# EAGLE design (S)NES2USB (EAGLE 9.5.1)
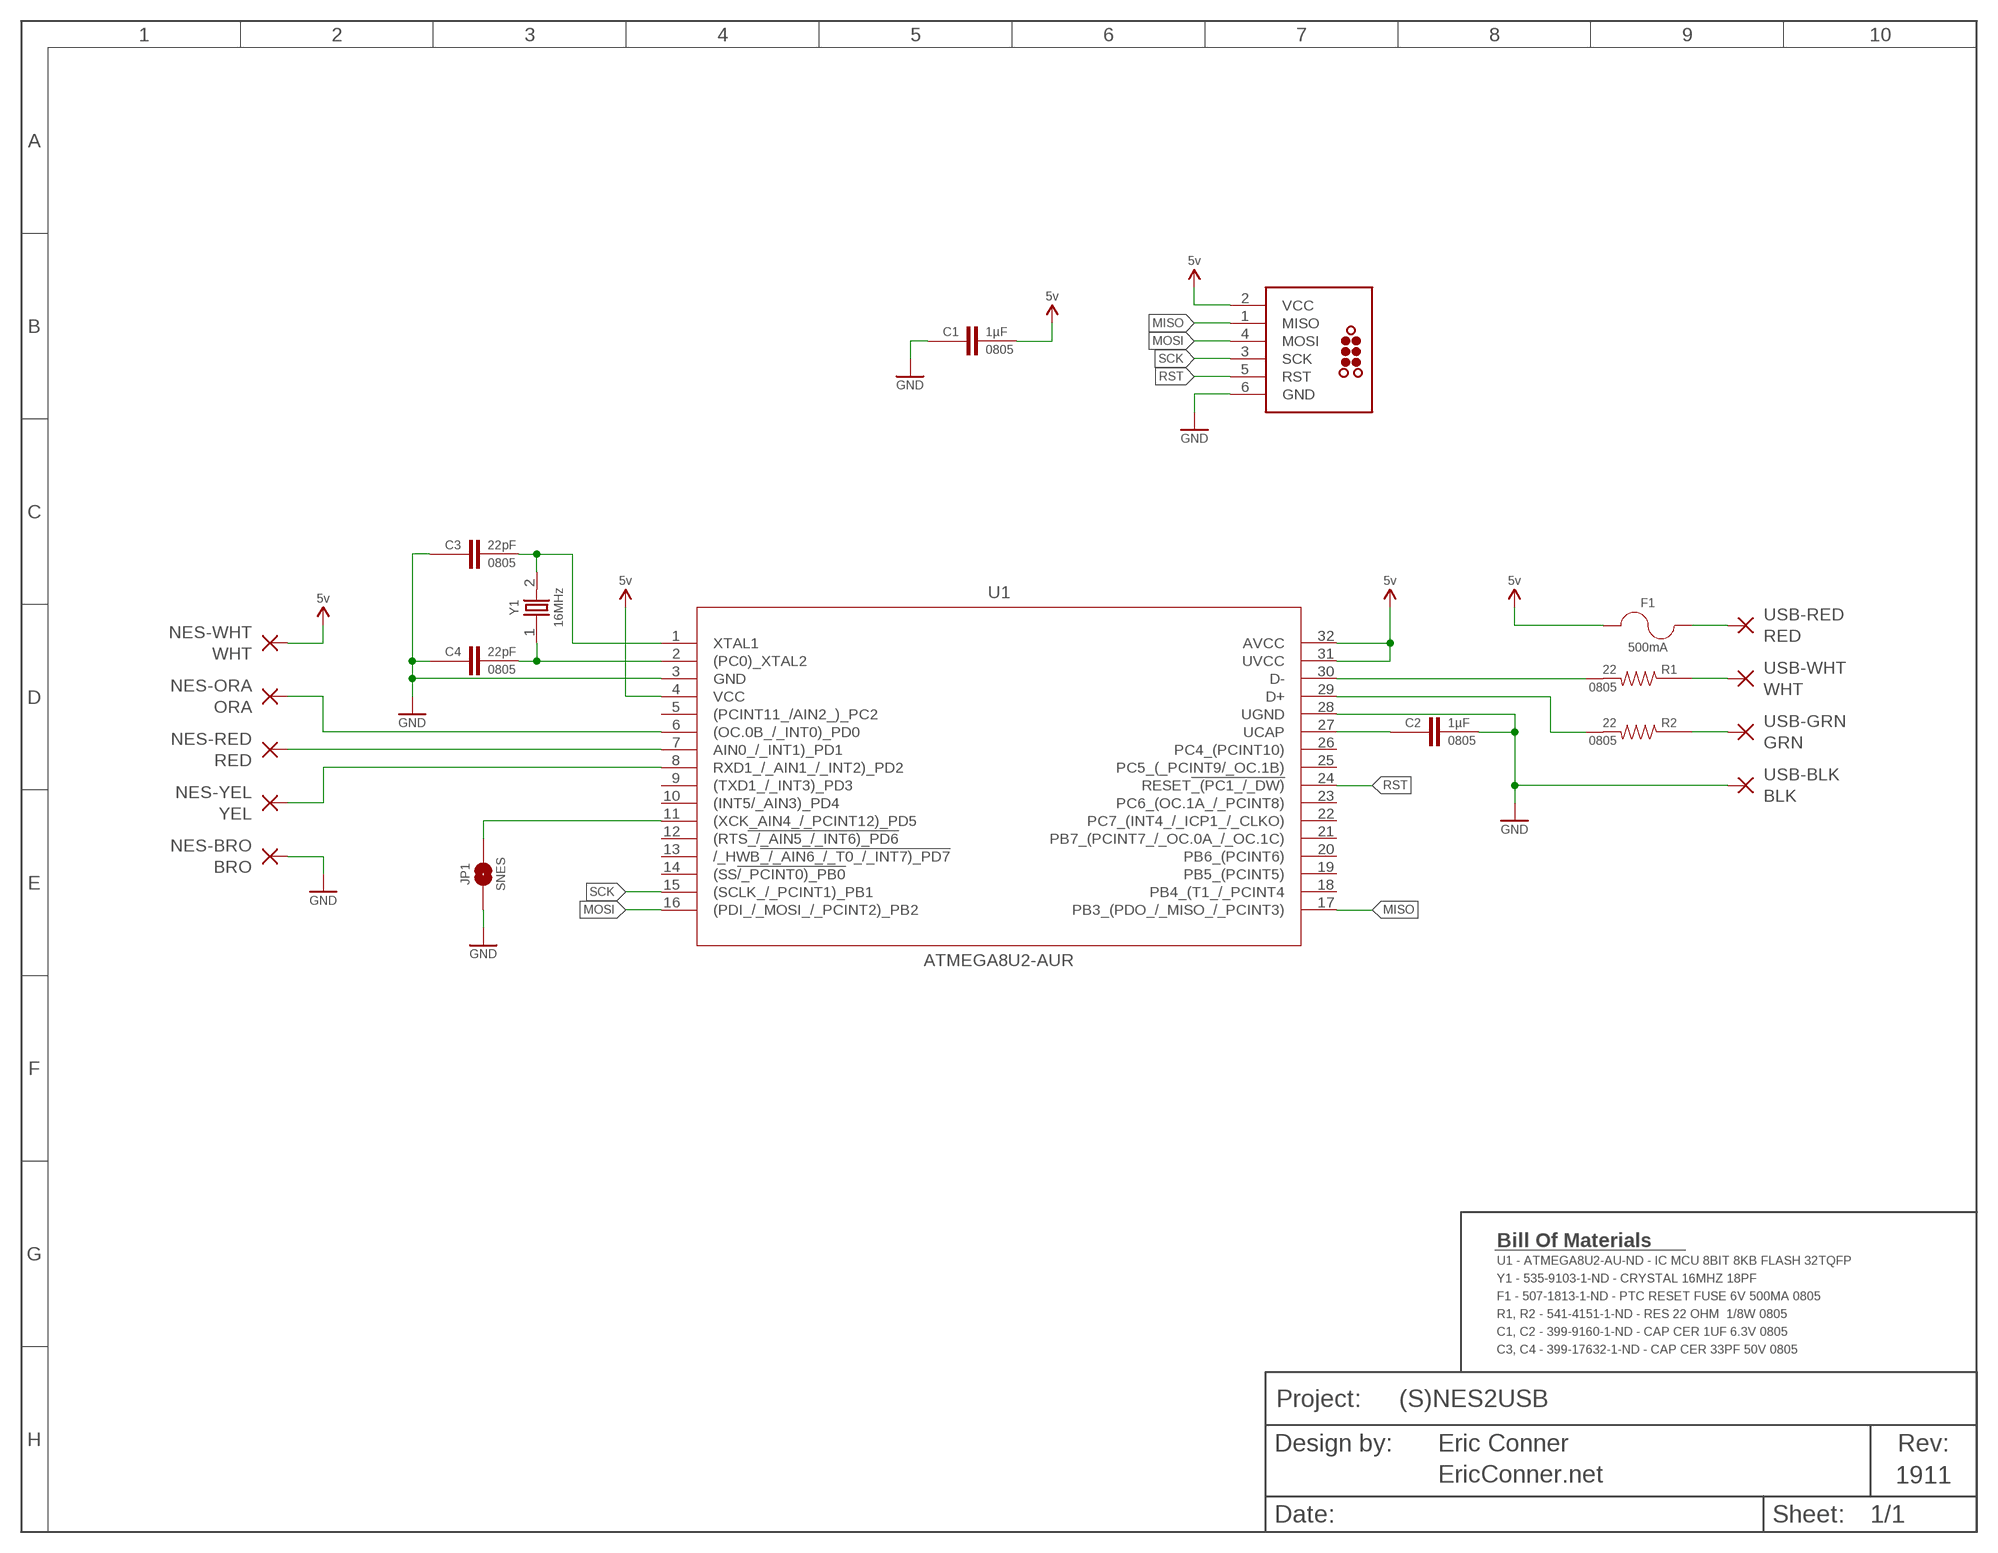
[diagram p0: schematic, sheet 1]

## Parts
BORDER1  BORDER_LETTER-MINIMAL  [MINIMAL_LOGO]
C1  1µF  CAP-0805  [0805]
C2  1µF  CAP-0805  [0805]
C3  22pF  CAP-0805  [0805]
C4  22pF  CAP-0805  [0805]
F1  500mA  POLYFUSE0ZCK0050FF2E  [0805]
J1  TC2030  [TC2030]
JP1  SNES  JUMPER-SMT_2_NO_SILK  [SMT-JUMPER_2_NO_SILK]
NES-BRO  BRO  WIREPADSMD1,27-254  [SMD1,27-2,54]
NES-ORA  ORA  WIREPADSMD1,27-254  [SMD1,27-2,54]
NES-RED  RED  WIREPADSMD1,27-254  [SMD1,27-2,54]
NES-WHT  WHT  WIREPADSMD1,27-254  [SMD1,27-2,54]
NES-YEL  YEL  WIREPADSMD1,27-254  [SMD1,27-2,54]
R1  22  RESISTOR-0805  [0805]
R2  22  RESISTOR-0805  [0805]
U1  ATMEGA8U2-AUR  [TQFP32]
USB-BLK  BLK  WIREPADSMD1,27-254  [SMD1,27-2,54]
USB-GRN  GRN  WIREPADSMD1,27-254  [SMD1,27-2,54]
USB-RED  RED  WIREPADSMD1,27-254  [SMD1,27-2,54]
USB-WHT  WHT  WIREPADSMD1,27-254  [SMD1,27-2,54]
Y1  16MHz  ABM3-16.000MHZ-B2-T  [XTAL500X320X130N]

## Nets
3V3: C2.1 U1.27(UCAP)
CLOCK: NES-RED.1(P) U1.7(AIN0_/_INT1)_PD1)
D+: R2.2 U1.29(D+)
D-: R1.2 U1.30(D-)
DATA: NES-YEL.1(P) U1.8(RXD1_/_AIN1_/_INT2)_PD2)
GND: C1.1 C2.2 C3.1 C4.1 J1.6(GND) JP1.1 NES-BRO.1(P) U1.3(GND) U1.28(UGND) USB-BLK.1(P)
LATCH: NES-ORA.1(P) U1.6((OC.0B_/_INT0)_PD0)
MISO: J1.1(MISO) U1.17(PB3_(PDO_/_MISO_/_PCINT3))
MOSI: J1.4(MOSI) U1.16((PDI_/_MOSI_/_PCINT2)_PB2)
RST: J1.5(RST) U1.24(RESET!_(PC1_/_DW))
SCK: J1.3(SCK) U1.15((SCLK_/_PCINT1)_PB1)
SNES: JP1.2 U1.11((XCK_AIN4_/_PCINT12)_PD5)
USB_5V: F1.1 USB-RED.1(P)
USB_D+: R2.1 USB-GRN.1(P)
USB_D-: R1.1 USB-WHT.1(P)
VCC: C1.2 F1.2 J1.2(VCC) NES-WHT.1(P) U1.4(VCC) U1.31(UVCC) U1.32(AVCC) ; supply symbol labelled 5V
XTAL1: C4.2 U1.2((PC0)_XTAL2) Y1.1
XTAL2: C3.2 U1.1(XTAL1) Y1.2
Unconnected: U1.5((PCINT11_/AIN2_)_PC2) U1.9((TXD1_/_INT3)_PD3) U1.10((INT5/_AIN3)_PD4) U1.12((RTS!_/_AIN5_/_INT6)_PD6) U1.13(/_HWB!_/_AIN6_/_T0_/_INT7)_PD7) U1.14((SS!/_PCINT0)_PB0) U1.18(PB4_(T1_/_PCINT4) U1.19(PB5_(PCINT5)) U1.20(PB6_(PCINT6)) U1.21(PB7_(PCINT7_/_OC.0A_/_OC.1C)) U1.22(PC7_(INT4_/_ICP1_/_CLKO)) U1.23(PC6_(OC.1A_/_PCINT8)) U1.25(PC5_(_PCINT9/_OC.1B)) U1.26(PC4_(PCINT10))

## Notes on the sheet
- Bill Of Materials
- U1 - ATMEGA8U2-AU-ND - IC MCU 8BIT 8KB FLASH 32TQFP
- Y1 - 535-9103-1-ND - CRYSTAL 16MHZ 18PF
- F1 - 507-1813-1-ND - PTC RESET FUSE 6V 500MA 0805
- R1, R2 - 541-4151-1-ND - RES 22 OHM  1/8W 0805
- C1, C2 - 399-9160-1-ND - CAP CER 1UF 6.3V 0805
- C3, C4 - 399-17632-1-ND - CAP CER 33PF 50V 0805

## Library data of the parts
BORDER1 = ECA-Aesthetics:BORDER_LETTER: 8.5x11 Schematic Border; DESIGNER: Eric Conner; PROJECT: (S)NES2USB; VERSION: 1911; WEBSITE: EricConner.net; YEAR: 2019
C1-C4 = ECA-Passives:CAP: Generic Capacitor; ATTRIBUTE: 0805
F1 = ECA-Passives:POLYFUSE; VENDOR: Belfuse
J1 = ECA-Connectors:TC2030: Tag-Connect ICSP Header
JP1 = ECA-Jumpers:JUMPER-SMT_2_NO: Normally open jumper This jumper has two pads in close proximity to each other. Apply solder to close the connection. Round pads are easier to solder for beginners, but are a lot larger. SparkFun Product that uses the round pads: SparkFun EL Sequencer <https://www.sparkfun.com/products/12781>
NES-BRO NES-ORA NES-RED NES-WHT NES-YEL USB-BLK USB-GRN USB-RED USB-WHT = wirepad:WIREPAD: Wire PAD connect wire on PCB
R1 R2 = ECA-Passives:RESISTOR: Generic Resistor; ATTRIBUTE: 0805
U1 = ECA-DigitalIC:ATMEGA8U2-AUR; MANUFACTURER_PART_NUMBER: ATMEGA8U2AUR; VENDOR: Atmel
Y1 = ECA-Passives:ABM3-16.000MHZ-B2-T: Crystals 12MHz 18pF 30ppm -40C +85C; DESCRIPTION: Crystal 16MHz Ø·Â¢Ø¢Â±20ppm _Tol_ Ø·Â¢Ø¢Â±50ppm _Stability_ 18pF FUND 50Ohm 2-Pin CSMD T/R; DIGI-KEY_PART_NUMBER: 535-9103-1-ND; DIGI-KEY_PURCHASE_URL: https://www.digikey.com/product-detail/en/abracon-llc/ABM3-16.000MHZ-B2-T/535-9103-1-ND/675620?utm_source=snapeda&utm_medium=aggregator&utm_campaign=symbol; MF: Abracon; MP: ABM3-16.000MHZ-B2-T; PACKAGE: SMD-2 Abracon

## Board
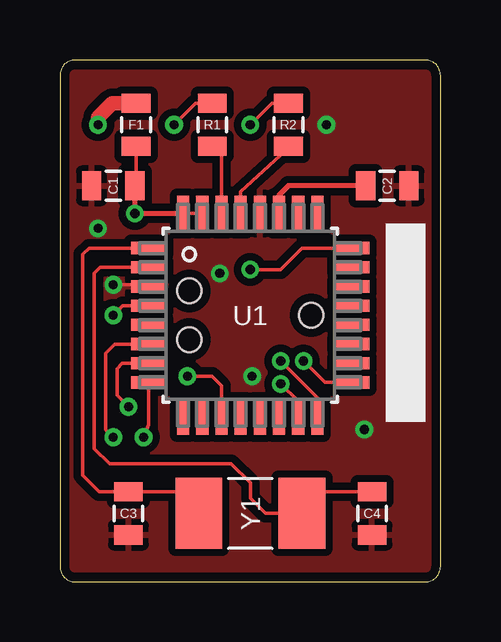
[diagram p1: board, top side]
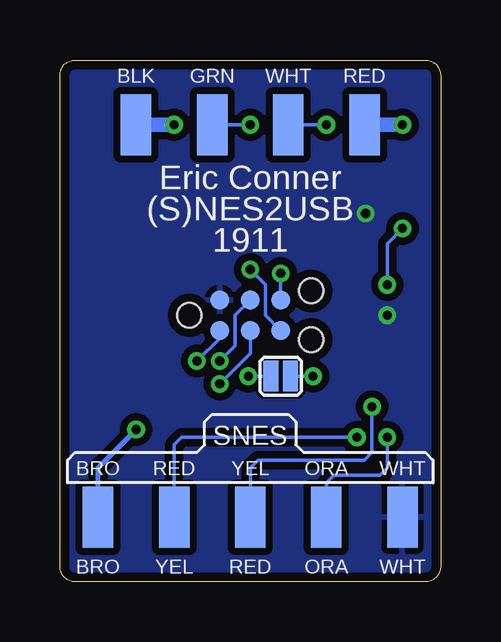
[diagram p2: board, bottom side, seen from below]

Size 15.88 x 21.75 mm. Coordinates in mm from the lower left corner, seen from the top.
Outline: 15.24,21.75 0.64,21.75 arc90 0,21.11 0,0.64 arc90 0.64,0 15.24,0 arc90 15.88,0.64 15.88,21.11 arc90 15.24,21.75
Copper layers (1*16): Top 0.0356mm / dielectric 1.5011mm / Bottom 0.0356mm
Design rules "LaenPCBOrder": minimum track width 6mil, minimum drill 13mil, track to track 6mil, track to pad 6mil, pad to pad 6mil, via to via 6mil, smd to smd 6mil, copper to edge 15mil, drill to drill 6mil, minimum pad ring 7mil, minimum via ring 7mil, stop-mask expansion 4mil, vias tented up to drill 0mil, thermal gap 10mil

### Footprints (pad centres in the part's own frame; a part is rotated, then mirrored left to right if it is on the bottom)
0805 = smd 0.8 x 1.2: 1 -0.9,0; 2 0.9,0
TC2030 = smd 0.787 x 0.787: 1 1.27,-0.635; 2 1.27,0.635; 3 2.54,-0.635; 4 2.54,0.635; 5 3.81,-0.635; 6 3.81,0.635 | hole 1.016: 0,0; 5.08,-1.016; 5.08,1.016
SMT-JUMPER_2_NO_SILK = smd 0.635 x 1.27: 1 -0.406,0; 2 0.406,0
SMD1,27-2,54 = smd 1.27 x 2.54: 1 0,0
TQFP32 = smd 1.473 x 0.508: 1 -4.242,2.8; 2 -4.242,2; 3 -4.242,1.2; 4 -4.242,0.4; 5 -4.242,-0.4; 6 -4.242,-1.2; 7 -4.242,-2; 8 -4.242,-2.8; 17 4.242,-2.8; 18 4.242,-2; 19 4.242,-1.2; 20 4.242,-0.4; 21 4.242,0.4; 22 4.242,1.2; 23 4.242,2; 24 4.242,2.8 | smd 0.508 x 1.473: 9 -2.8,-4.242; 10 -2,-4.242; 11 -1.2,-4.242; 12 -0.4,-4.242; 13 0.4,-4.242; 14 1.2,-4.242; 15 2,-4.242; 16 2.8,-4.242; 25 2.8,4.242; 26 2,4.242; 27 1.2,4.242; 28 0.4,4.242; 29 -0.4,4.242; 30 -1.2,4.242; 31 -2,4.242; 32 -2.8,4.242
XTAL500X320X130N = smd 1.95 x 2.95: 1 -2.15,0; 2 2.15,0

### Placement (x,y rotation side)
BORDER1  7.94,15.56 0 bottom
C1  2.22,16.51 0 top
C2  13.65,16.51 0 top
C3  2.86,2.86 90 top
C4  13.02,2.86 90 top
F1  3.17,19.05 270 top
J1  10.48,11.11 0 bottom
JP1  6.67,8.57 0 bottom
NES-BRO  14.29,2.7 0 bottom
NES-ORA  4.76,2.7 0 bottom
NES-RED  7.94,2.7 0 bottom
NES-WHT  1.59,2.7 0 bottom
NES-YEL  11.11,2.7 0 bottom
R1  6.35,19.05 270 top
R2  9.53,19.05 270 top
U1  7.94,11.11 0 top
USB-BLK  12.7,19.05 0 bottom
USB-GRN  9.53,19.05 0 bottom
USB-RED  3.17,19.05 0 bottom
USB-WHT  6.35,19.05 0 bottom
Y1  7.94,2.86 180 top

### Tracks (layer width: path | path; a pad name or v marks a point on that pad's centre or on a via)
3V3
  Top 0.203: U1.27 9.14,16.12 9.53,16.51 C2.1
CLOCK  (via drill 0.38)
  Top 0.152: U1.7 2.6,9.11 2.38,8.89 2.38,7.78 v2.86,7.3
  Bottom 0.152: v2.86,7.3 2.86,5.4 3.17,5.08 7.62,5.08 7.94,4.76 NES-RED.1
D+
  Top 0.152: U1.29 7.54,16.27 9.21,17.78 R2.2
D-
  Top 0.152: U1.30 6.74,18.08 R1.2
DATA  (via drill 0.38)
  Top 0.152: U1.8 3.7,6.55 v3.49,6.03
  Bottom 0.152: v3.49,6.03 10.79,6.03 11.11,5.71 NES-YEL.1
GND  (via drill 0.38)
  Top 0.152: U1.3 3.63,12.38 v2.22,12.38
  Bottom 0.152: v2.22,12.38 2.22,14.1 v1.59,14.73 | v6.67,12.86 J1.6 | JP1.1 v8.02,8.57
  Bottom 0.203: NES-BRO.1 14.29,4.76 v12.7,6.35
  Bottom 0.61: USB-BLK.1 v11.11,19.05
  pour Top (isolate 0.305): 0,21.75 0,0 15.88,0 15.88,21.75
LATCH  (via drill 0.38)
  Top 0.152: U1.6 2.29,9.91 1.91,9.53 1.91,6.35 v2.22,6.03
  Bottom 0.152: v2.22,6.03 2.22,4.76 2.54,4.45 4.45,4.45 4.76,4.13 NES-ORA.1
MISO  (via drill 0.38)
  Top 0.152: U1.17 11.05,8.31 v10.16,9.21
  Bottom 0.152: J1.1 9.21,10.16 v10.16,9.21
MOSI  (via drill 0.38)
  Top 0.152: U1.16 10.74,7.68 v9.21,9.21
  Bottom 0.152: J1.4 8.57,11.11 8.57,9.84 v9.21,9.21
RST  (via drill 0.38)
  Top 0.152: U1.24 10.1,13.91 9.21,13.02 v7.94,13.02
  Bottom 0.152: J1.5 7.3,11.11 7.3,12.38 v7.94,13.02
SCK  (via drill 0.38)
  Top 0.152: U1.15 9.94,7.53 v9.21,8.26
  Bottom 0.152: J1.3 7.94,9.53 v9.21,8.26
SNES  (via drill 0.38)
  Top 0.152: U1.11 6.74,8.19 6.35,8.57 v5.32,8.57
  Bottom 0.152: JP1.2 v5.32,8.57
USB_5V  (via drill 0.38)
  Top 0.61: 3.12,19.95 F1.1 2.17,19.95 1.59,19.37 v1.59,19.05
  Bottom 0.61: USB-RED.1 v1.59,19.05
USB_D+  (via drill 0.38)
  Top 0.152: R2.1 8.84,19.95 v7.94,19.05
  Bottom 0.152: USB-GRN.1 v7.94,19.05
USB_D-  (via drill 0.38)
  Top 0.152: R1.1 5.66,19.95 v4.76,19.05
  Bottom 0.152: USB-WHT.1 v4.76,19.05
VCC  (via drill 0.38)
  Top 0.152: U1.32 U1.31 | U1.4 2.62,11.51 v2.22,11.11 | 3.12,18.15 F1.2 3.17,16.51 C1.2
  Top 0.203: C1.2 v3.12,15.35 U1.32
  pour Bottom (isolate 0.305): 0,21.75 15.88,21.75 15.88,0 0,0
XTAL1
  Top 0.152: U1.2 1.68,13.11 1.43,12.86 1.43,5.56 2.06,4.92 7.14,4.92 7.94,4.13 7.94,3.49 8.57,2.86 Y1.1 10.99,3.76 C4.2
XTAL2
  Top 0.152: U1.1 1.21,13.91 0.95,13.65 0.95,4.45 1.64,3.76 C3.2 4.89,3.76 Y1.2

### Text on the board
bPlace: SNES | WHT | ORA | YEL | RED | BRO